# EAGLE schematic DAC_buffer_non-inv (EAGLE 9.6.2)
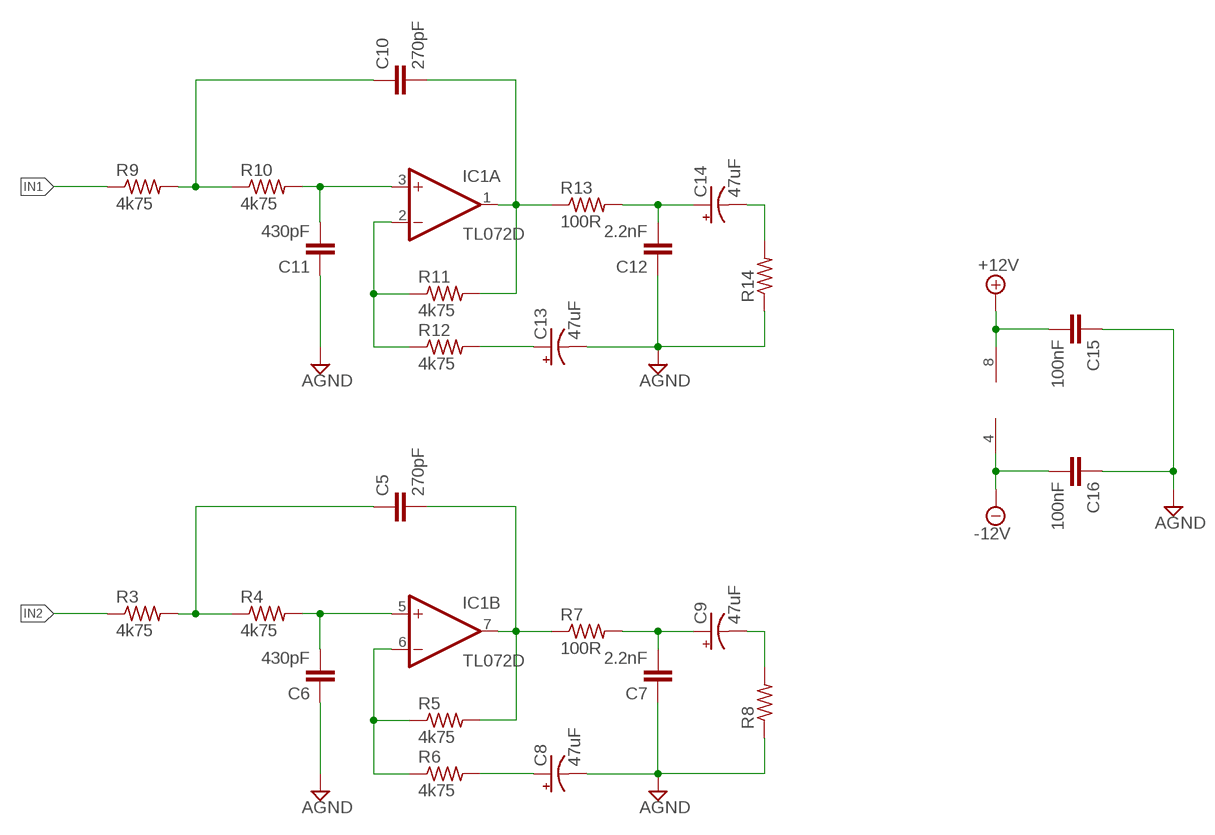
[diagram p0: schematic, sheet 1]

## Parts
C5  270pF  C-EUC0603  [C0603]
C6  430pF  C-EUC0603  [C0603]
C7  2.2nF  C-EUC0603  [C0603]
C8  47uF  CPOL-USA  [PANASONIC_A]
C9  47uF  CPOL-USA  [PANASONIC_A]
C10  270pF  C-EUC0603  [C0603]
C11  430pF  C-EUC0603  [C0603]
C12  2.2nF  C-EUC0603  [C0603]
C13  47uF  CPOL-USA  [PANASONIC_A]
C14  47uF  CPOL-USA  [PANASONIC_A]
C15  100nF  C-EUC0603  [C0603]
C16  100nF  C-EUC0603  [C0603]
IC1  TL072D  [SO08]
R3  4k75  R-US_R0603  [R0603]
R4  4k75  R-US_R0603  [R0603]
R5  4k75  R-US_R0603  [R0603]
R6  4k75  R-US_R0603  [R0603]
R7  100R  R-US_R0603  [R0603]
R8  R-US_R0603  [R0603]
R9  4k75  R-US_R0603  [R0603]
R10  4k75  R-US_R0603  [R0603]
R11  4k75  R-US_R0603  [R0603]
R12  4k75  R-US_R0603  [R0603]
R13  100R  R-US_R0603  [R0603]
R14  R-US_R0603  [R0603]

## Nets
+12V: C15.2 IC1.8(P:V+)
-12V: C16.2 IC1.4(P:V-)
AGND: C6.1 C7.1 C8.- C11.1 C12.1 C13.- C15.1 C16.1 R8.1 R14.1
IN1: R9.1
IN2: R3.1
N$2: C5.1 R3.2 R4.1
N$3: C6.2 IC1.5(B:+IN) R4.2
N$5: C5.2 IC1.7(B:OUT) R5.2 R7.1
N$6: IC1.6(B:-IN) R5.1 R6.1
N$7: C7.2 C9.+ R7.2
N$8: C9.- R8.2
N$9: C8.+ R6.2
N$10: C10.1 R9.2 R10.1
N$11: C11.2 IC1.3(A:+IN) R10.2
N$12: C10.2 IC1.1(A:OUT) R11.2 R13.1
N$13: IC1.2(A:-IN) R11.1 R12.1
N$14: C12.2 C14.+ R13.2
N$15: C13.+ R12.2
N$16: C14.- R14.2

## Library data of the parts
C5-C7 C10-C12 C15 C16 = rcl:C-EU: CAPACITOR, European symbol; SPICEPREFIX: C
C8 C9 C13 C14 = rcl:CPOL-US: POLARIZED CAPACITOR, American symbol; SPICEPREFIX: C
IC1 = linear:TL072: OP AMP
R3-R14 = rcl:R-US_: RESISTOR, American symbol; SPICEPREFIX: R